# EAGLE design D2D-BOTTOM (EAGLE 9.6.1)
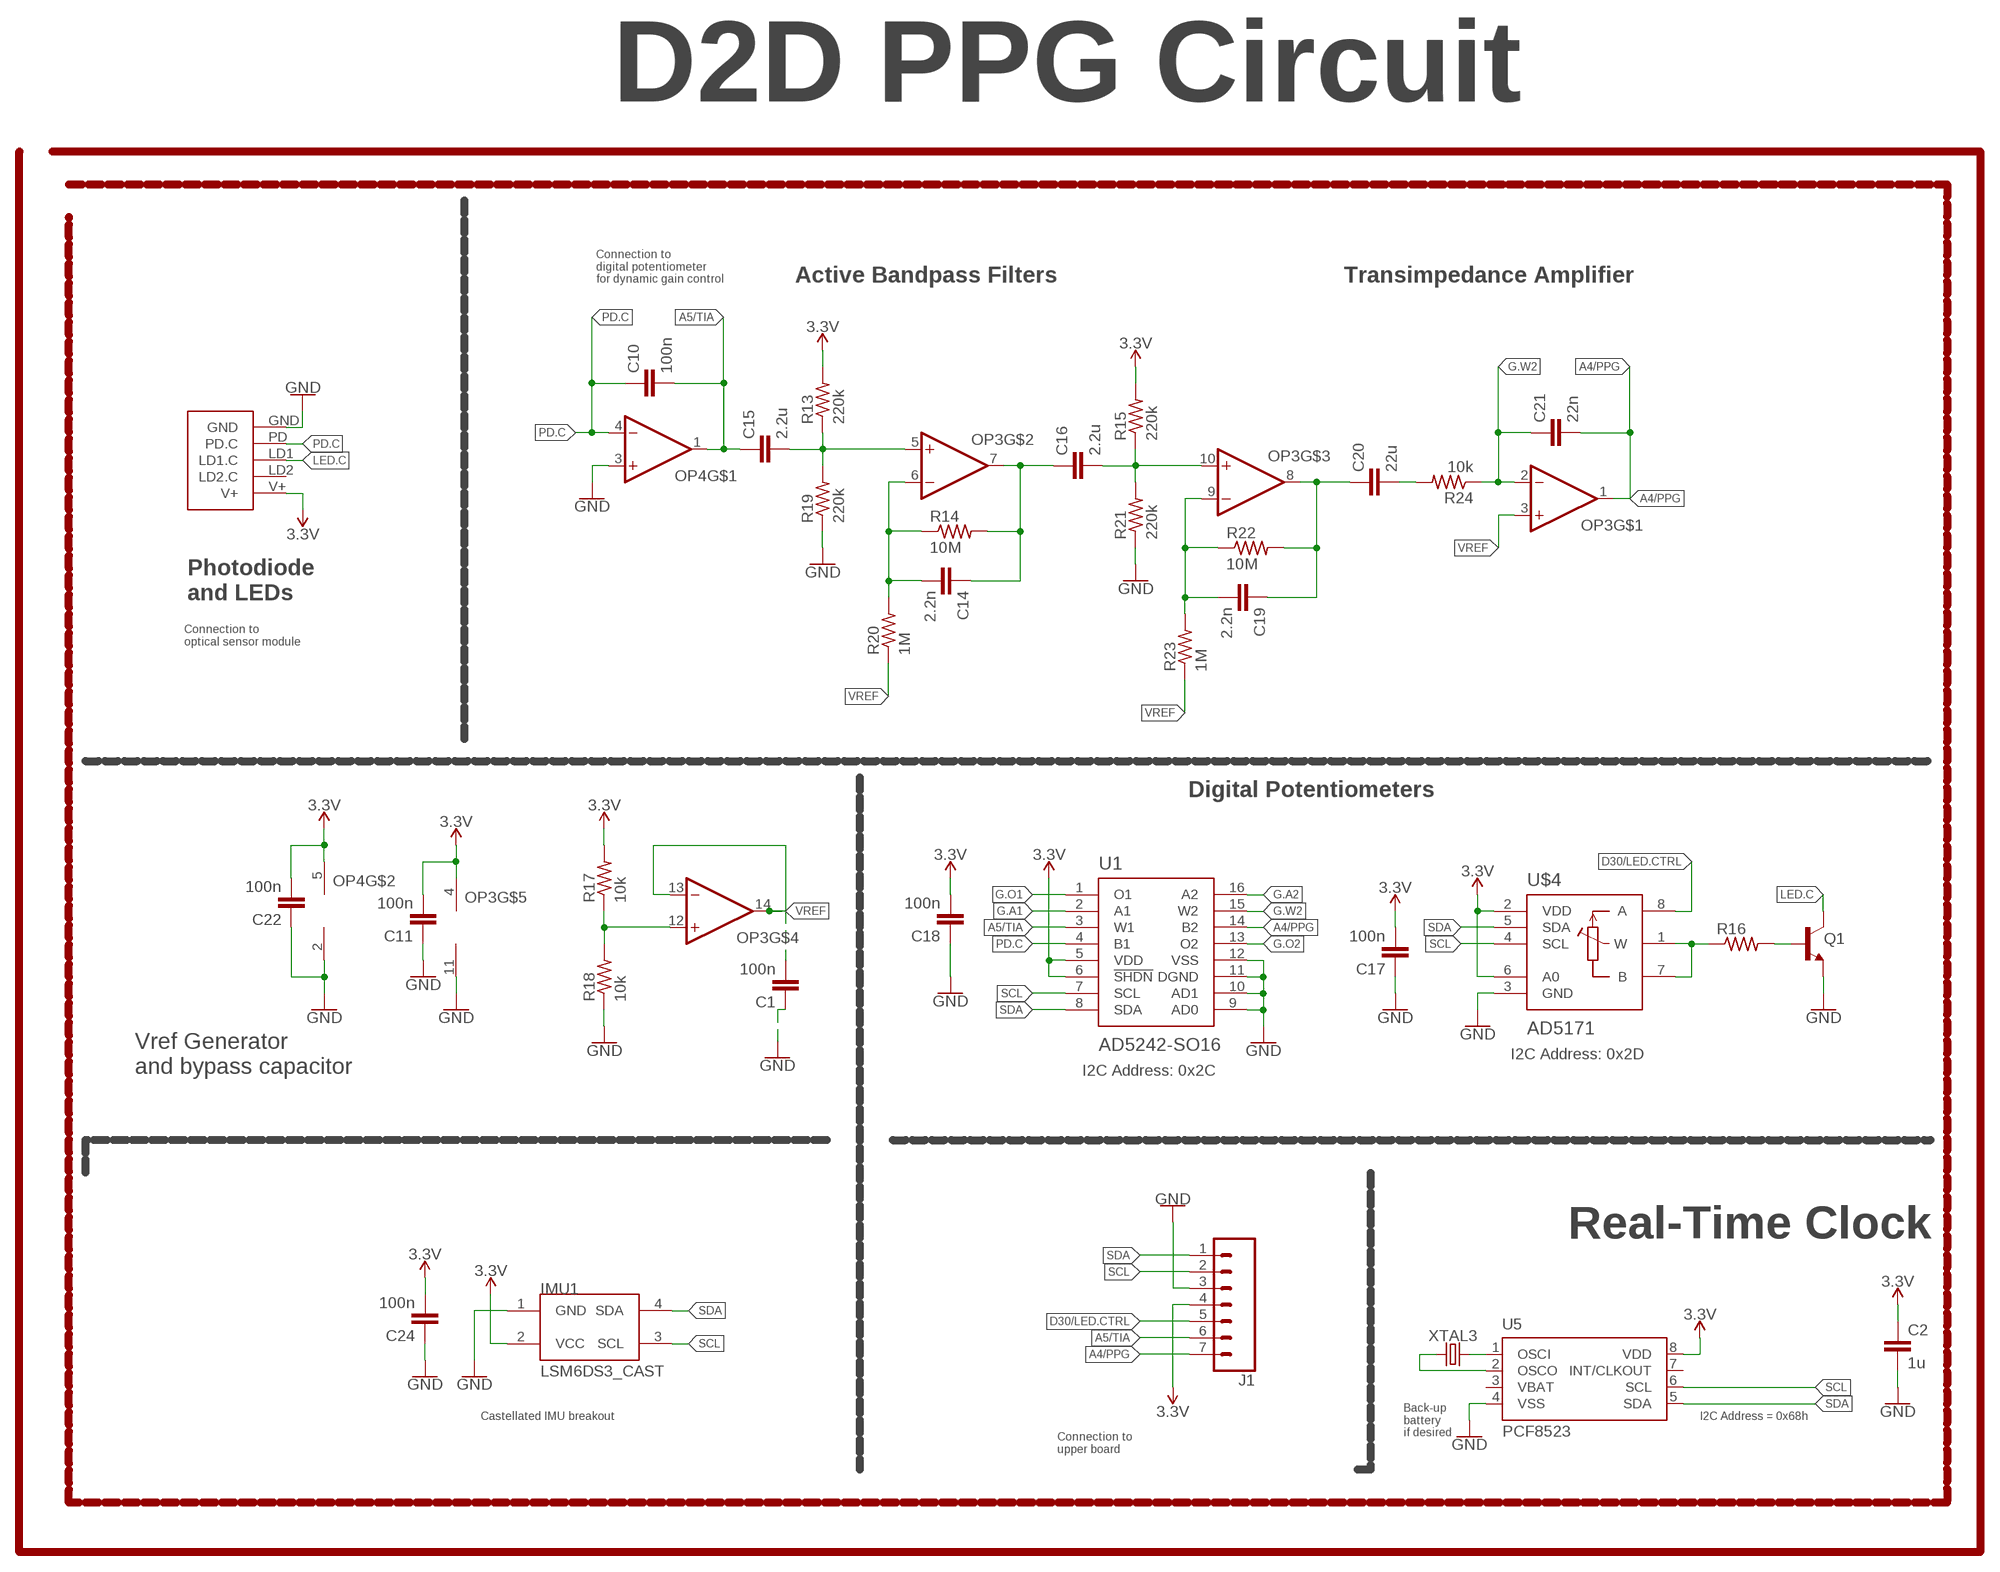
[diagram p0: schematic, sheet 1]

## Parts
C1  100n  CAPACITOR0603  [C0603]
C2  1u  CAPACITOR0603  [C0603]
C10  100n  CAPACITOR0603  [C0603]
C11  100n  CAPACITOR0603  [C0603]
C14  2.2n  CAPACITOR0603  [C0603]
C15  2.2u  CAPACITOR0603  [C0603]
C16  2.2u  CAPACITOR0603  [C0603]
C17  100n  CAPACITOR0603  [C0603]
C18  100n  CAPACITOR0603  [C0603]
C19  2.2n  CAPACITOR0603  [C0603]
C20  22u  CAPACITOR0603  [C0603]
C21  22n  CAPACITOR0603  [C0603]
C22  100n  CAPACITOR0603  [C0603]
C24  100n  CAPACITOR0603  [C0603]
IMU1  LSM6DS3_CAST  [LSM6DS3_CAST]
J1  CONN_07-1.27MM  [1X07_1.27MM]
OP3  OP-QUAD-SO14  [SO14]
OP4  OP-SINGLEOT  [SOT23-5]
Q1  NPN-GENERIC  [SOT23-3]
R13  220k  RESISTOR0603  [R0603]
R14  10M  RESISTOR0603  [R0603]
R15  220k  RESISTOR0603  [R0603]
R16  RESISTOR0603  [R0603]
R17  10k  RESISTOR0402  [R0402]
R18  10k  RESISTOR0402  [R0402]
R19  220k  RESISTOR0603  [R0603]
R20  1M  RESISTOR0603  [R0603]
R21  220k  RESISTOR0603  [R0603]
R22  10M  RESISTOR0603  [R0603]
R23  1M  RESISTOR0603  [R0603]
R24  10k  RESISTOR0603  [R0603]
U1  AD5242-SO16  [SO16]
U5  PCF8523  [SO8]
U$3  PPG.MODULE.2  [PPG.MODULE.2]
U$4  AD5171  [SOT-23-8]
XTAL3  32.7680kHz  CRYSTALECS-.327-12.5-12-C-TR  [2-SMD.NOLEAD.2.0MMTO1.2MM]

## Nets
3.3V: C2.1 C11.2 C17.2 C18.2 C22.2 C24.2 IMU1.2(VCC) J1.4 OP3.4(V+) OP4.5(V+) R13.2 R15.2 R17.2 U1.5(VDD) U1.6(!SHDN) U5.8(VDD) U$3.V+ U$4.2(VDD) U$4.6(A0)
A4/PPG: C21.2 J1.7 OP3.1(OUT) U1.14(B2)
A5/TIA: C10.2 C15.1 J1.6 OP4.1(OUT) U1.3(W1)
D30/LED.CTRL: J1.5 U$4.8(A)
G.A1: U1.2(A1)
G.A2: U1.16(A2)
G.O1: U1.1(O1)
G.O2: U1.13(O2)
G.W2: C21.1 OP3.2(-IN) R24.1 U1.15(W2)
GND: C1.1 C2.2 C11.1 C17.1 C18.1 C22.1 C24.1 IMU1.1(GND) J1.3 OP3.11(V-) OP4.2(V-) OP4.3(+IN) Q1.2(E) R18.1 R19.1 R21.1 U1.9(AD0) U1.10(AD1) U1.11(DGND) U1.12(VSS) U5.4(VSS) U$3.GND U$4.3(GND)
LED.C: Q1.3(C) U$3.LD1(LD1.C)
N$1: U5.2(OSCO) XTAL3.P$1
N$2: U5.1(OSCI) XTAL3.P$2
N$8: Q1.1(B) R16.2
N$9: R16.1 U$4.1(W) U$4.7(B)
N$10: OP3.12(+IN) R17.1 R18.2
N$13: C15.2 OP3.5(+IN) R13.1 R19.2
N$15: C14.2 OP3.6(-IN) R14.1 R20.2
N$16: C14.1 C16.1 OP3.7(OUT) R14.2
N$17: C16.2 OP3.10(+IN) R15.1 R21.2
N$18: C19.2 OP3.9(-IN) R22.1 R23.2
N$19: C19.1 C20.1 OP3.8(OUT) R22.2
N$20: C20.2 R24.2
PD.C: C10.1 OP4.4(-IN) U1.4(B1) U$3.PD(PD.C)
SCL: IMU1.3(SCL) J1.2 U1.7(SCL) U5.6(SCL) U$4.4(SCL)
SDA: IMU1.4(SDA) J1.1 U1.8(SDA) U5.5(SDA) U$4.5(SDA)
VREF: C1.2 OP3.3(+IN) OP3.13(-IN) OP3.14(OUT) R20.1 R23.1
Unconnected: U5.7(INT/CLKOUT) U$3.LD2(LD2.C)

## Notes on the sheet
- D2D PPG Circuit
- Connection to
  digital potentiometer
  for dynamic gain control
- Active Bandpass Filters | Transimpedance Amplifier
- Photodiode
  and LEDs
- Connection to
  optical sensor module
- Digital Potentiometers
- I2C Address: 0x2D
- Vref Generator
  and bypass capacitor
- I2C Address: 0x2C
- Real-Time Clock
- Castellated IMU breakout | I2C Address = 0x68h
- Back-up
  battery
  if desired
- Connection to
  upper board

## Power pins joined to a net without a drawn wire
VBAT: U5.3(VBAT)

## Library data of the parts
C1 C2 C10 C11 C14-C22 C24 = LinnesLab-Passives:CAPACITOR
IMU1 = LinnesLab-Sensors:LSM6DS3_CAST
J1 = LinnesLab-Connectors:CONN_07: Multi connection point. Often used as Generic Header-pin footprint for 0.1 inch spaced/style header connections On any of the 0.1 inch spaced packages, you can populate with these: Break Away Headers - Straight <https://www.sparkfun.com/products/116> (PRT-00116) Break Away Male Headers - Right Angle <https://www.sparkfun.com/products/553> (PRT-00553) Female Headers <https://www.sparkfun.com/products/115> (PRT-00115) Break Away Headers - Machine Pin <https://www.sparkfun.com/products/117> (PRT-00117) Break Away Female Headers - Swiss Machine Pin <https://www.sparkfun.com/products/743> (PRT-00743) For SCREWTERMINALS and SPRING TERMINALS visit here: Screw Terimnals on SparkFun.com <https://www.sparkfun.com/search/results?term=Screw+Terminals> (5mm/3.5mm/2.54mm spacing) This device is also useful as a general connection point to wire up your design to another part of your project. Our various solder wires solder well into these plated through hole pads. Hook-Up Wire - Assortment (Stranded, 22 AWG) <https://www.sparkfun.com/products/11375> (PRT-11375) Hook-Up Wire - Assortment (Solid Core, 22 AWG) <https://www.sparkfun.com/products/11367> (PRT-11367) View the entire wire category on our website here <https://www.sparkfun.com/categories/141> Special notes: Molex polarized connector foot print use with SKU : PRT-08231 with associated crimp pins and housings. 1MM SMD Version SKU: PRT-10208 NOTES ON THE VARIANTS LOCK and LOCK_LONGPADS... This footprint was designed to help hold the alignment of a through-hole component (i.e. 6-pin header) while soldering it into place. You may notice that each hole has been shifted either up or down by 0.005 of an inch from it's more standard position (which is a perfectly straight line). This slight alteration caused the pins (the squares in the middle) to touch the edges of the holes. Because they are alternating, it causes a "brace" to hold the component in place. 0.005 has proven to be the perfect amount of "off-center" position when using our standard breakaway headers. Although looks a little odd when you look at the bare footprint, once you have a header in there, the alteration is very hard to notice. Also,if you push a header all the way into place, it is covered up entirely on the bottom side.
OP3 = LinnesLab-AnalogIC:OP-QUAD: General symbol and footprints for Quad Op Amps. Use with any standard general purpose op amp.
OP4 = LinnesLab-AnalogIC:OP-SINGLE: Single Op Amp 2.7V to 6.0V Single Supply CMOS Source: http://ww1.microchip.com/downloads/en/DeviceDoc/21314g.pdf
Q1 = LinnesLab-DiscreteSemi:NPN
R13-R24 = LinnesLab-Passives:RESISTOR
U1 = LinnesLab-DigitalIC:AD5242
U5 = LinnesLab-Clocks:PCF8523; DIGIKEY: 568-5306-1-ND; I2C_ADDRESS: 0x68h; MFN: PCF8523T/1,118; MFN_MANUFACTURER: NXP USA Inc.
U$3 = LinnesLab-Connectors:PPG.MODULE.2: Digi-Key Part Number: S9014E-50-ND Manufacturer Part Number: GRPB501VWVN-RC Description: 1mm insulation height 0.05in pitch 50 positions
U$4 = LinnesLab-DigitalIC:AD5171
XTAL3 = LinnesLab-Clocks:CRYSTAL; DIGIKEY: XC2288CT-ND; FREQ: 32.7680KHZ; LOAD_CAP: 12.5pF

## Board
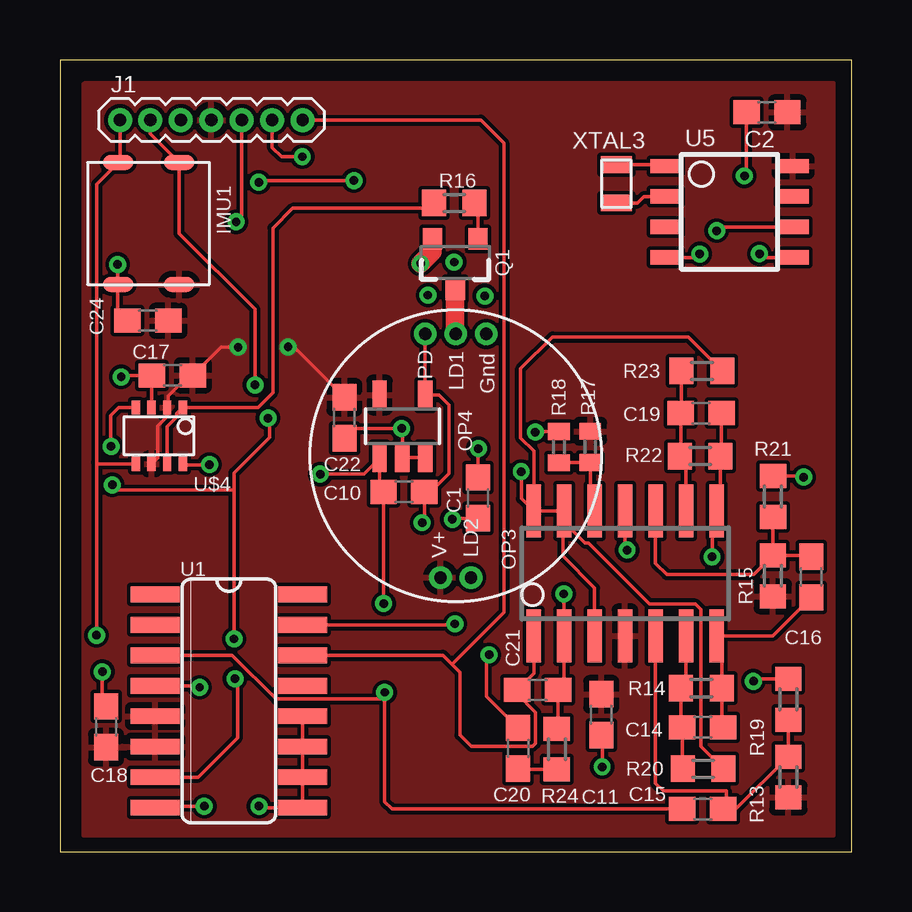
[diagram p1: board, top side]
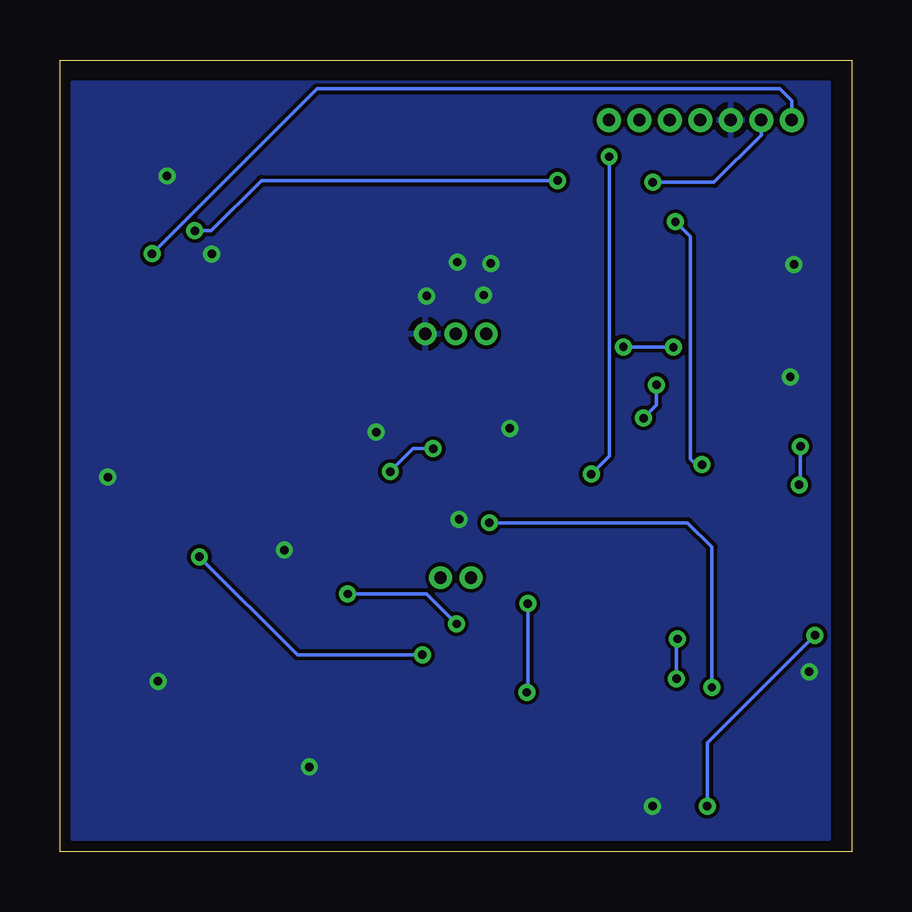
[diagram p2: board, bottom side, seen from below]

Size 33 x 33 mm. Coordinates in mm from the lower left corner, seen from the top.
Outline: 0,0 33,0 33,33 0,33 0,0
Copper layers (1*16): Top 0.0356mm / dielectric 1.5011mm / Bottom 0.0356mm
Design rules "PCBWay-Safe": minimum track width 6mil, minimum drill 12mil, track to track 6mil, track to pad 6mil, pad to pad 6mil, via to via 6mil, smd to smd 6mil, copper to edge 15mil, drill to drill 6mil, minimum pad ring 7mil, minimum via ring 7mil, stop-mask expansion 3mil, vias tented up to drill 0mil, thermal gap 10mil

### Footprints (pad centres in the part's own frame; a part is rotated, then mirrored left to right if it is on the bottom)
C0603 = smd 1.1 x 1: 1 -0.85,0; 2 0.85,0
LSM6DS3_CAST = smd 0.635 x 1.27: 1 -2.54,1.27; 2 -2.54,-1.27; 3 2.54,-1.27; 4 2.54,1.27
1X07_1.27MM = drill 0.508 pad 1: 1 0,0; 2 1.27,0; 3 2.54,0; 4 3.81,0; 5 5.08,0; 6 6.35,0; 7 7.62,0
SO14 = smd 0.6 x 2.2: 1 -3.81,-2.6; 2 -2.54,-2.6; 3 -1.27,-2.6; 4 0,-2.6; 5 1.27,-2.6; 6 2.54,-2.6; 7 3.81,-2.6; 8 3.81,2.6; 9 2.54,2.6; 10 1.27,2.6; 11 0,2.6; 12 -1.27,2.6; 13 -2.54,2.6; 14 -3.81,2.6
SOT23-5 = smd 0.6 x 1.2: 1 -0.95,-1.306; 2 0,-1.306; 3 0.95,-1.306; 4 0.95,1.306; 5 -0.95,1.306
SOT23-3 = smd 0.8 x 0.9: 1 -0.95,-1; 2 0.95,-1; 3 0,1.1
R0603 = smd 1 x 1.1: 1 -0.85,0; 2 0.85,0
R0402 = smd 0.7 x 0.9: 1 -0.65,0; 2 0.65,0
SO16 = smd 0.66 x 2.032: 1 -4.445,-3.073; 2 -3.175,-3.073; 3 -1.905,-3.073; 4 -0.635,-3.073; 5 0.635,-3.073; 6 1.905,-3.073; 7 3.175,-3.073; 8 4.445,-3.073; 9 4.445,3.073; 10 3.175,3.073; 11 1.905,3.073; 12 0.635,3.073; 13 -0.635,3.073; 14 -1.905,3.073; 15 -3.175,3.073; 16 -4.445,3.073
SO8 = smd 1.3 x 0.6: 1 -2.65,1.905; 2 -2.65,0.635; 3 -2.65,-0.635; 4 -2.65,-1.905; 5 2.65,-1.905; 6 2.65,-0.635; 7 2.65,0.635; 8 2.65,1.905
PPG.MODULE.2 = drill 0.508 pad 0.94: GND 1.27,5.08; LD1 0,5.08; LD2 0.635,-5.08; PD -1.27,5.08; V+ -0.635,-5.08
SOT-23-8 = smd 0.35 x 0.6: 1 -0.991,-1.176; 2 -0.341,-1.176; 3 0.309,-1.176; 4 0.959,-1.176; 5 0.959,1.176; 6 0.309,1.176; 7 -0.341,1.176; 8 -0.991,1.176
2-SMD.NOLEAD.2.0MMTO1.2MM = smd 0.7 x 1.3: P$1 -0.8,0; P$2 0.8,0

### Placement (x,y rotation side)
C1  17.43,14.74 90 top
C2  29.47,30.82 180 top
C10  14.34,15 180 top
C11  22.57,5.71 90 top
C14  26.79,5.19 180 top
C15  26.79,1.77 0 top
C16  31.32,11.44 90 top
C17  4.69,19.84 0 top
C18  1.92,5.2 270 top
C19  26.73,18.28 180 top
C20  19.1,4.3 270 top
C21  19.92,6.75 180 top
C22  11.86,18.09 90 top
C24  3.67,22.13 0 top
IMU1  3.7,26.18 90 top
J1  2.5,30.5 0 top
OP3  23.56,11.59 0 top
OP4  14.27,17.73 0 top
Q1  16.48,24.55 180 top
R13  30.36,3.11 270 top
R14  26.74,6.81 0 top
R15  29.72,11.5 270 top
R16  16.44,27.04 0 top
R17  22.1,16.87 90 top
R18  20.8,16.86 270 top
R19  30.36,6.35 270 top
R20  26.81,3.45 180 top
R21  29.72,14.8 270 top
R22  26.69,16.48 0 top
R23  26.76,20.03 180 top
R24  20.71,4.27 270 top
U1  7.04,6.28 270 top
U5  27.91,26.67 0 top
U$3  16.5,16.5 0 top
U$4  4.13,17.33 180 top
XTAL3  23.19,27.84 90 top

### Tracks (layer width: path | path; a pad name or v marks a point on that pad's centre or on a via)
3.3V  (via drill 0.35)
  Top 0.152: U$4.6 4.06,16.41 4.06,17.74 4.47,18.14 U$4.2 4.51,18.55 4.51,18.99 5.36,19.84 C17.2 6.72,21.02 v7.43,21.02 | v9.51,21.04 9.76,21.04 C22.2
  Bottom 0.152: v7.43,21.02 7.44,21.04 v9.51,21.04
  pour Top: 1.04,32.05 32.26,32.05 32.26,0.65 0.97,0.65 0.97,32.02
A4/PPG
  Top 0.152: U1.14 15.97,8.18 16.35,7.8 | 16.35,7.8 16.67,7.48 16.67,4.86 17.16,4.38 19.7,4.38 19.83,4.51 19.83,5.8 19.07,6.56 C21.2 19.75,7.43 OP3.1 | J1.7 17.55,30.5 18.51,29.54 18.51,9.96 16.35,7.8
A5/TIA  (via drill 0.35)
  Top 0.152: OP4.1 13.32,16.38 | 13.32,16.38 13.32,15.16 C10.2 v13.49,10.34 v13.5,10.34 | v13.54,6.63 13.54,6.26 | 13.54,6.26 13.54,2.08 13.84,1.77 C15.1 | 13.54,6.26 13.44,6.35 9,6.35 7.17,8.18 U1.3 | J1.6 8.85,29.35 9.23,28.97 v10.1,28.97 | v10.85,15.73 12.67,15.73 13.32,16.38
  Bottom 0.152: v13.5,10.34 13.5,6.67 v13.54,6.63 | v10.1,28.97 10.1,16.48 v10.85,15.73
D30/LED.CTRL  (via drill 0.35)
  Top 0.152: U$4.8 5.17,16.11 6.21,16.11 v6.23,16.13 | J1.5 7.58,26.49 v7.35,26.25
  Bottom 0.152: v6.23,16.13 6.48,16.13 6.72,16.36 6.72,25.62 v7.35,26.25
G.W2  (via drill 0.35)
  Top 0.152: U1.15 16.43,9.45 v16.46,9.49 | v21,10.74 21,9.01 OP3.2 21.02,6.79 20.77,6.53 | C21.1 20.77,6.53 | 20.77,6.53 20.77,5.17 R24.1
  Bottom 0.152: v16.46,9.49 17.71,10.74 v21,10.74
GND  (via drill 0.35)
  Top 0.152: C22.1 12.27,17.64 v14.25,17.64 14.27,17.61 OP4.2 OP4.3 | U1.12 U1.11 U1.10 U1.9 8.35,1.83 v8.29,1.89 | C18.1 1.77,6.21 v1.77,7.49 | 2.4,23.66 IMU1.1 | 2.4,23.66 v2.4,24.48 | C24.1 2.4,22.55 2.4,23.66 | U$4.3 3.82,19.82 C17.1 2.61,19.84 v2.55,19.79 | R18.1 19.84,17.51 v19.81,17.48 | R21.1 30.96,15.65 v31,15.61 | R19.1 29,7.2 v28.91,7.1 | C11.1 22.61,4.82 v22.61,3.53 | OP3.11 23.56,12.65 v23.65,12.56 | C1.1 16.4,13.89 v16.36,13.85 | C2.2 28.62,28.25 v28.54,28.17 | U5.4 26.52,24.76 v26.67,24.91
  Top 0.762: Q1.2 15.53,25 v15.04,24.51
  other vias: 17.71,23.16 15.34,23.2 16.44,24.57
  pour Bottom: 32.48,32.06 32.48,0.5 0.93,0.5 0.93,32.06
LED.C
  Top 0.762: Q1.3 16.48,21.6 U$3.LD1
N$1
  Top 0.152: XTAL3.P$1 24.08,27.04 24.34,27.3 U5.2
N$2
  Top 0.152: XTAL3.P$2 25.2,28.64 U5.1
N$8
  Top 0.152: R16.2 17.43,26.9 Q1.1
N$9
  Top 0.152: R16.1 15.36,26.81 9.7,26.81 8.88,25.99 8.88,19.14 8.25,18.51 U$4.1 4.87,18.27 4.87,18.12 4.47,17.71 U$4.7
N$10
  Top 0.152: R18.2 R17.1 22.11,14.38 OP3.12
N$13
  Top 0.152: OP3.5 24.83,2.84 25.15,2.53 27.78,2.53 27.78,1.91 C15.2 28.18,1.77 R13.1 R19.2
N$15
  Top 0.152: OP3.6 26.1,7.02 R14.1 25.89,5.24 C14.2 25.94,3.47 R20.2
N$16
  Top 0.152: C16.1 29.72,8.99 OP3.7 27.59,8.77 R14.2 27.59,6.69 27.59,5.24 C14.1
N$17
  Top 0.152: R21.2 R15.1 | R15.1 31.26,12.35 C16.2 | OP3.10 24.83,12.01 25.29,11.55 28.93,11.55 R15.1
N$18
  Top 0.152: OP3.9 26.1,16.22 R22.1 25.88,16.52 C19.2 25.91,18.32 R23.2
N$19  (via drill 0.35)
  Top 0.152: R22.2 27.54,16.24 | 27.54,16.24 27.54,14.36 OP3.8 27.19,14.01 v27.19,12.29 | C19.1 27.57,16.27 27.54,16.24 | C20.1 17.79,6.47 17.79,8.1 v17.89,8.2
  Bottom 0.152: v17.89,8.2 23.1,8.2 v27.19,12.29
N$20
  Top 0.152: R24.2 19.14,3.42 C20.2
PD.C  (via drill 0.35)
  Top 0.152: OP4.4 | OP4.4 U$3.PD | OP4.4 15.8,19.04 16.22,18.62 16.22,15.77 15.45,15 C10.1 15.19,13.8 v15.1,13.71 | U1.4 5.75,6.91 v5.82,6.84
  Bottom 0.152: v5.82,6.84 5.82,12.69 6.84,13.71 v15.1,13.71
SCL  (via drill 0.35)
  Top 0.152: J1.2 3.77,29.92 IMU1.3 4.96,25.77 8.13,22.61 v8.13,19.46 | U1.7 5.77,3.1 7.41,4.74 7.41,7.09 v7.29,7.21 | v7.26,8.86 7.26,15.08 | 7.26,15.08 7.26,15.78 8.73,17.26 8.73,18.01 v8.67,18.07 | U$4.4 2.46,18.51 2.12,18.18 2.12,16.91 v2.13,16.89 | v2.18,15.29 2.39,15.08 7.26,15.08 | U5.6 27.53,26.03 v27.38,25.88 | v8.29,27.9 8.36,27.98 v12.26,27.98
  Bottom 0.152: v7.29,7.21 7.29,8.83 v7.26,8.86 | v8.67,18.07 8.13,18.61 v8.13,19.46 | v2.13,16.89 2.13,15.34 v2.18,15.29 | J1.2 3.77,29.87 5.73,27.9 v8.29,27.9 | v12.26,27.98 24.59,27.98 26.69,25.88 v27.38,25.88
SDA  (via drill 0.35)
  Top 0.152: J1.1 2.5,28.8 IMU1.4 1.53,27.82 1.53,16.23 | 1.53,16.23 v1.53,9.01 | v6.02,1.89 4.02,1.89 U1.8 | U$4.5 1.6,16.16 1.53,16.23 | U5.5 29.32,24.76 v29.16,24.92
  Bottom 0.152: v1.53,9.01 6.02,4.52 v6.02,1.89 | v29.16,24.92 22.28,31.8 2.99,31.8 2.5,31.3 J1.1
VREF  (via drill 0.35)
  Top 0.152: OP3.14 19.75,16.69 19.21,17.23 19.21,20.13 20.53,21.45 26.19,21.45 R23.1 | R20.1 26.72,4.39 26.72,10.09 26.5,10.32 24.57,10.32 22.03,12.86 21.9,12.86 21.02,13.74 21.02,14.1 | 21.02,14.1 OP3.13 | OP3.3 22.29,10.99 20.96,12.31 20.96,14.05 21.02,14.1 | OP3.14 20.93,14.19 21.02,14.1 | C1.2 v17.43,16.79 v17.44,16.8 | v19.23,15.84 19.23,14.71 OP3.14
  Bottom 0.152: v17.44,16.8 18.27,16.8 v19.23,15.84